# EAGLE schematic D-SP-X1-01-A (EAGLE 9.6.2)
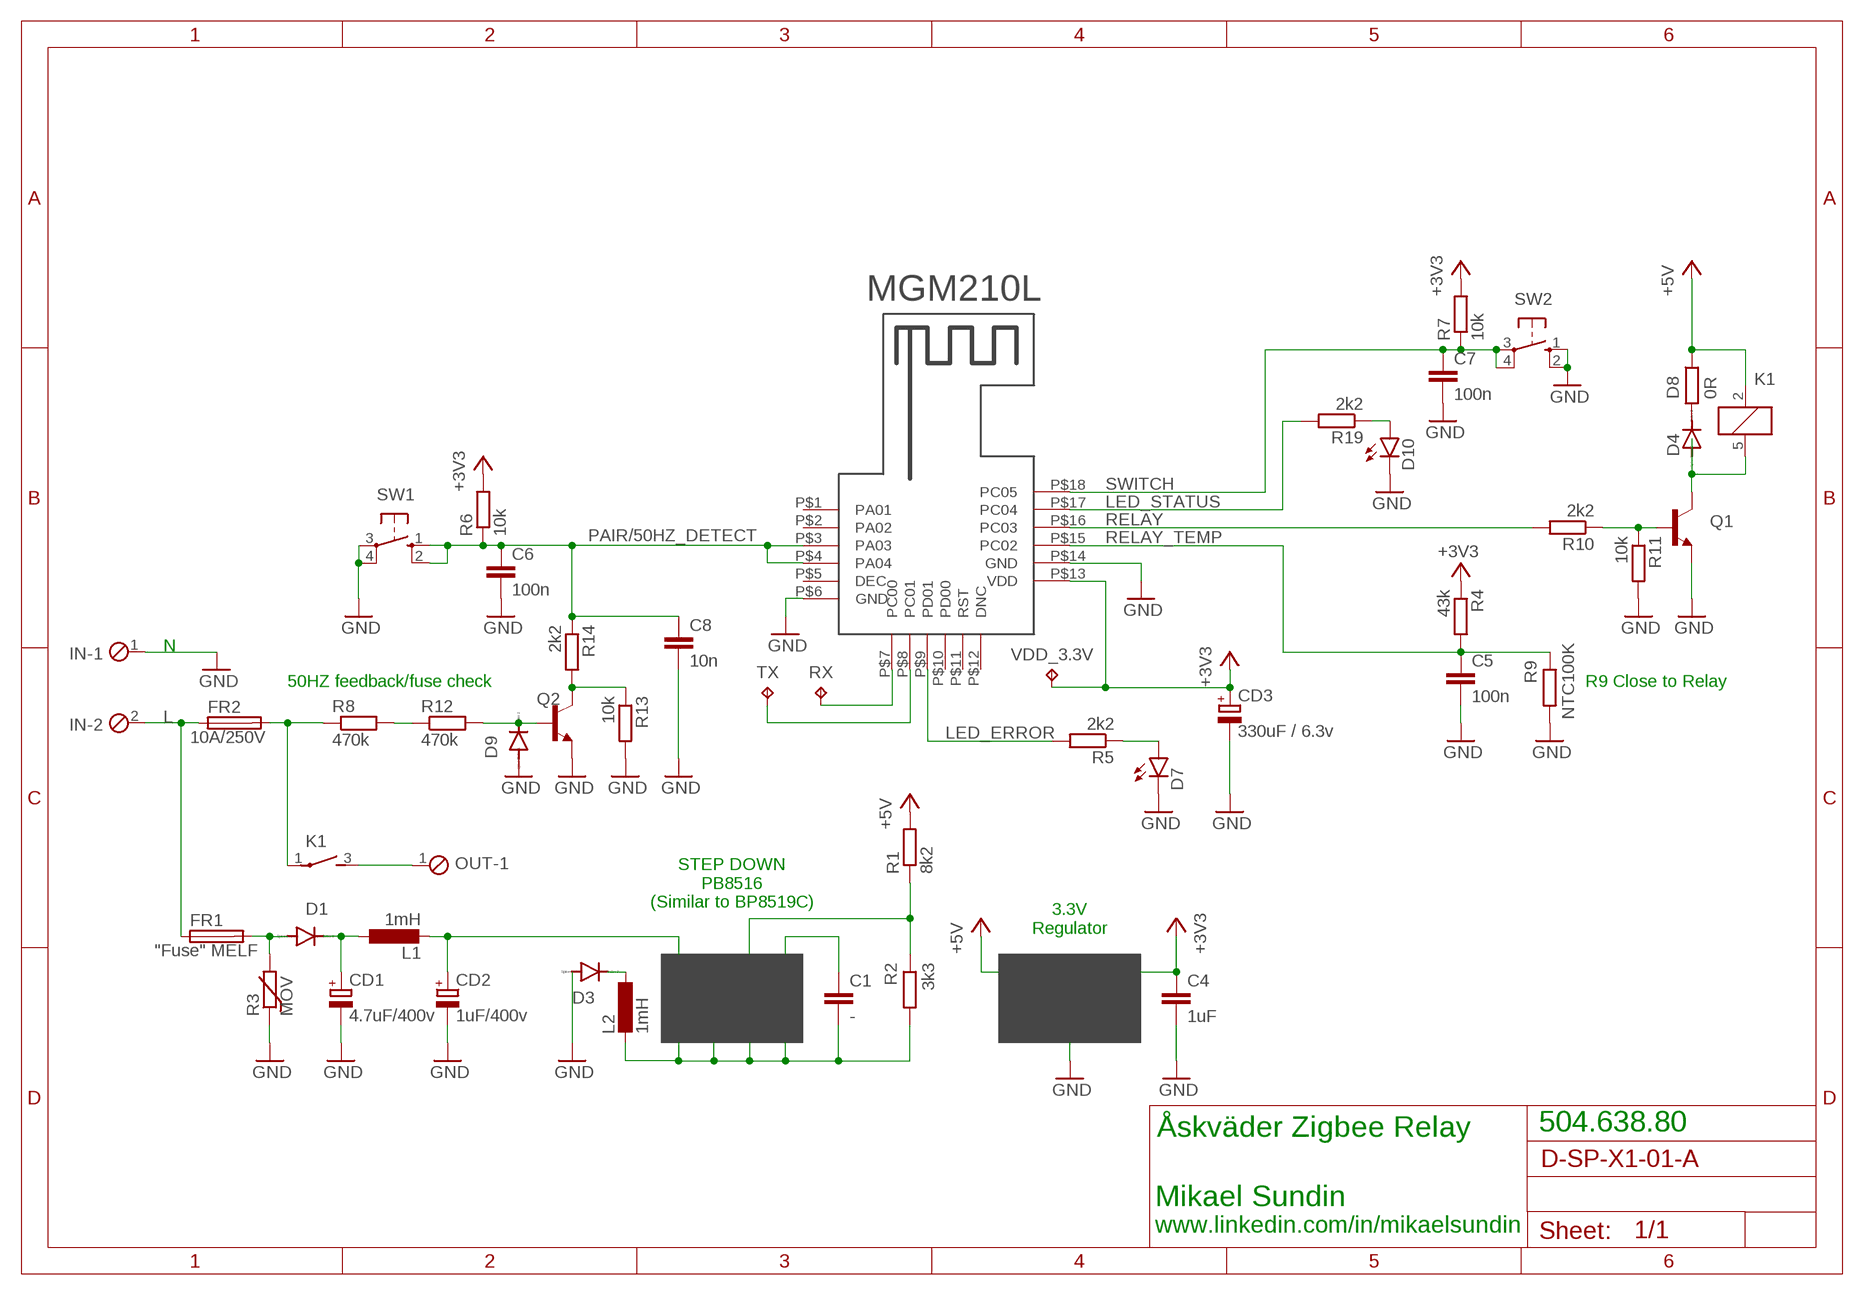
[diagram p0: schematic, sheet 1]

## Parts
C1  -  C-EUC0603  [C0603]
C4  1uF  C-EUC0603  [C0603]
C5  100n  C-EUC0603  [C0603]
C6  100n  C-EUC0603  [C0603]
C7  100n  C-EUC0603  [C0603]
C8  10n  C-EUC0603  [C0603]
CD1  4.7uF/400v  CPOL-EUE2.5-6  [E2,5-6]
CD2  1uF/400v  CPOL-EUE2.5-6  [E2,5-6]
CD3  330uF / 6.3v  CPOL-EUE2.5-6  [E2,5-6]
D1  DIODE-SCD80-INFINEON  [SCD80_INFINEON]
D3  DIODE-SCD80-INFINEON  [SCD80_INFINEON]
D4  DIODE-SCD80-INFINEON  [SCD80_INFINEON]
D7  LEDCHIP-LED0603  [CHIP-LED0603]
D8  0R  R-EU_R0603  [R0603]
D9  DIODE-SCD80-INFINEON  [SCD80_INFINEON]
D10  LEDCHIP-LED0603  [CHIP-LED0603]
FR1  "Fuse" MELF  FUSELITTLEFUSE  [LITTLEFUSE]
FR2  10A/250V  FUSELITTLEFUSE  [LITTLEFUSE]
IN  MPT2  [2POL254]
K1  AZ8-FORM-A  [AZ8]
L1  1mH  L-EU0204V  [0204V]
L2  1mH  L-EU0204V  [0204V]
OUT  MPT2  [2POL254]
Q1  BC850-NPN-SOT23-BEC  [SOT23-BEC]
Q2  BC850-NPN-SOT23-BEC  [SOT23-BEC]
R1  8k2  R-EU_R0603  [R0603]
R2  3k3  R-EU_R0603  [R0603]
R3  MOV  R-EU_R1206  [R1206]
R4  43k  R-EU_R0603  [R0603]
R5  2k2  R-EU_R0603  [R0603]
R6  10k  R-EU_R0603  [R0603]
R7  10k  R-EU_R0603  [R0603]
R8  470k  R-EU_R1206  [R1206]
R9  NTC100K  R-EU_R0603  [R0603]
R10  2k2  R-EU_R0603  [R0603]
R11  10k  R-EU_R0603  [R0603]
R12  470k  R-EU_R1206  [R1206]
R13  10k  R-EU_R0603  [R0603]
R14  2k2  R-EU_R0603  [R0603]
R19  2k2  R-EU_R0603  [R0603]
RX  TPTP17R  [TP17R]
SW1  10-XX  [B3F-10XX]
SW2  10-XX  [B3F-10XX]
TX  TPTP17R  [TP17R]
U$1  MGM210L  [MGM210L]
VDD_3.3V  TPTP17R  [TP17R]

## Nets
+3V3: C4.1 CD3.+ R4.1 R6.2 R7.2 U$1.P$13(VDD) VDD_3.3V.TP
+5V: D8.1 K1.2 R1.2
GND: C4.2 C5.2 C6.2 C7.2 C8.2 CD1.- CD2.- CD3.- D3.A D7.C D9.A D10.C Q1.E Q2.E R3.1 R9.2 R11.2 R13.2 SW1.3(P) SW1.4(P1) SW2.1(S) SW2.2(S1) U$1.P$6(GND) U$1.P$14(GND)
L: FR1.1 FR2.1 IN.2
LED_ERROR: R5.2 U$1.P$9(PD01)
LED_STATUS: R19.2 U$1.P$17(PC04)
N: IN.1 ; supply symbol labelled GND
N$1: RX.TP U$1.P$7(PC00)
N$2: TX.TP U$1.P$8(PC01)
N$3: D10.A R19.1
N$4: D7.A R5.1
N$5: Q1.B R10.1 R11.1
N$6: D4.A K1.5 Q1.C
N$7: D4.C D8.2
N$8: R8.2 R12.1
N$9: D9.C Q2.B R12.2
N$10: Q2.C R13.1 R14.2
N$11: FR2.2 K1.1(-1:P) R8.1
N$12: K1.3(-1:S) OUT.1
N$13: D1.A FR1.2 R3.2
N$14: CD1.+ D1.C L1.1
N$15: CD2.+ L1.2
N$16: C1.2 L2.2 R2.2
N$17: C1.1
N$18: R1.1 R2.1
N$19: D3.C L2.1
PAIR/50HZ_DETECT: C6.1 C8.1 R6.1 R14.1 SW1.1(S) SW1.2(S1) U$1.P$3(PA03) U$1.P$4(PA04)
RELAY: R10.2 U$1.P$16(PC03)
RELAY_TEMP: C5.1 R4.2 R9.1 U$1.P$15(PC02)
SWITCH: C7.1 R7.1 SW2.3(P) SW2.4(P1) U$1.P$18(PC05)
Unconnected: OUT.2 U$1.P$1(PA01) U$1.P$2(PA02) U$1.P$5(DEC) U$1.P$10(PD00) U$1.P$11(RST) U$1.P$12(DNC)

## Notes on the sheet
- MGM210L
- N
- 50HZ feedback/fuse check | R9 Close to Relay
- STEP DOWN
  PB8516
  (Similar to BP8519C)
- 3.3V
  Regulator
- Åskväder Zigbee Relay | 504.638.80
- Mikael Sundin
- www.linkedin.com/in/mikaelsundin

## Library data of the parts
C1 C4-C8 = rcl:C-EU: CAPACITOR, European symbol; SPICEPREFIX: C
CD1-CD3 = rcl:CPOL-EU: POLARIZED CAPACITOR, European symbol; SPICEPREFIX: C
D1 D3 D4 D9 = diode:DIODE-: DIODE
D7 D10 = led:LED: LED OSRAM: - CHIPLED LG R971, LG N971, LY N971, LG Q971, LY Q971, LO R971, LY R971 LH N974, LH R974 LS Q976, LO Q976, LY Q976 LO Q996 - Hyper CHIPLED LW Q18S LB Q993, LB Q99A, LB R99A - SideLED LS A670, LO A670, LY A670, LG A670, LP A670 LB A673, LV A673, LT A673, LW A673 LH A674 LY A675 LS A676, LA A676, LO A676, LY A676, LW A676 LS A679, LY A679, LG A679 - Hyper Micro SIDELED® LS Y876, LA Y876, LO Y876, LY Y876 LT Y87S - SmartLED LW L88C, LW L88S LB L89C, LB L89S, LG L890 LS L89K, LO L89K, LY L89K LS L896, LA L896, LO L896, LY L896 - TOPLED LS T670, LO T670, LY T670, LG T670, LP T670 LSG T670, LSP T670, LSY T670, LOP T670, LYG T670 LG T671, LOG T671, LSG T671 LB T673, LV T673, LT T673, LW T673 LH T674 LS T676, LA T676, LO T676, LY T676, LB T676, LH T676, LSB T676, LW T676 LB T67C, LV T67C, LT T67C, LS T67K, LO T67K, LY T67K, LW E67C LS E67B, LA E67B, LO E67B, LY E67B, LB E67C, LV E67C, LT E67C LW T67C LS T679, LY T679, LG T679 LS T770, LO T770, LY T770, LG T770, LP T770 LB T773, LV T773, LT T773, LW T773 LH T774 LS E675, LA E675, LY E675, LS T675 LS T776, LA T776, LO T776, LY T776, LB T776 LHGB T686 LT T68C, LB T68C - Hyper Mini TOPLED® LB M676 - Mini TOPLED Santana® LG M470 LS M47K, LO M47K, LY M47K Source: http://www.osram.convergy.de LUXEON: - LUMILED® LXK2-PW12-R00, LXK2-PW12-S00, LXK2-PW14-U00, LXK2-PW14-V00 LXK2-PM12-R00, LXK2-PM12-S00, LXK2-PM14-U00 LXK2-PE12-Q00, LXK2-PE12-R00, LXK2-PE12-S00, LXK2-PE14-T00, LXK2-PE14-U00 LXK2-PB12-K00, LXK2-PB12-L00, LXK2-PB12-M00, LXK2-PB14-N00, LXK2-PB14-P00, LXK2-PB14-Q00 LXK2-PR12-L00, LXK2-PR12-M00, LXK2-PR14-Q00, LXK2-PR14-R00 LXK2-PD12-Q00, LXK2-PD12-R00, LXK2-PD12-S00 LXK2-PH12-R00, LXK2-PH12-S00 LXK2-PL12-P00, LXK2-PL12-Q00, LXK2-PL12-R00 Source: www.luxeon.com KINGBRIGHT: KA-3528ASYC Source: www.kingbright.com
D8 R1-R14 R19 = rcl:R-EU_: RESISTOR, European symbol; SPICEPREFIX: R
FR1 FR2 = fuse:FUSE: Fuse; OC_FARNELL: unknown; OC_NEWARK: unknown
IN OUT = con-phoenix-254:MPT2: PHOENIX CONNECTOR; OC_FARNELL: unknown; OC_NEWARK: unknown
K1 = relay:AZ8-FORM-A: MINIATURE PC BOARD RELAY Form A Source: www.azettler.com .. AZ8-1ch-12DSE.PDF; OC_FARNELL: unknown; OC_NEWARK: unknown
L1 L2 = rcl:L-EU: INDUCTOR, European symbol; SPICEPREFIX: L
Q1 Q2 = transistor:*-NPN-: NPN Transistror BF959 corrected 2008.03.06
RX TX VDD_3.3V = testpad:TP: Test pad
SW1 SW2 = switch-omron:10-XX: OMRON SWITCH; MPN: B3F-1000; OC_FARNELL: 176432; OC_NEWARK: 36M3542
U$1 = mgm210:MGM210L